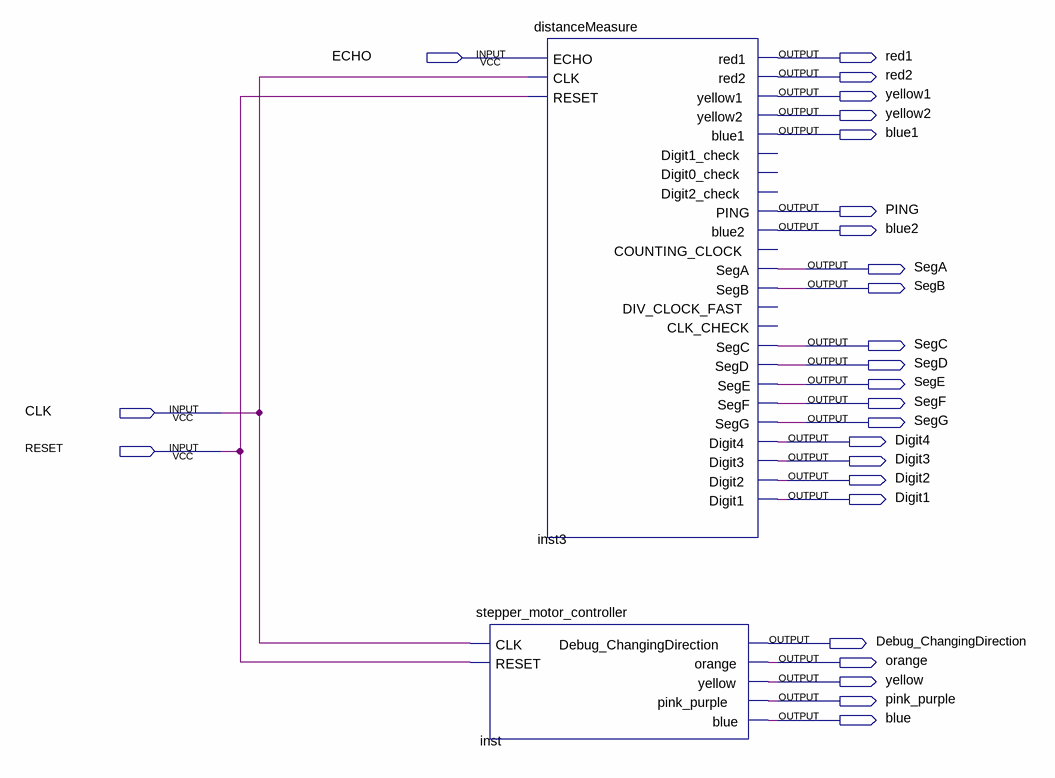
[diagram p0: schematic sheet]
// Quartus schematic FINAL_RADAR_SYSTEM_TOP_LEVEL.bdf as structural Verilog: 2 symbols, 26 pins
module FINAL_RADAR_SYSTEM_TOP_LEVEL (
  input  ECHO,
  input  CLK,
  input  RESET,
  output red1,
  output red2,
  output yellow1,
  output yellow2,
  output blue1,
  output PING,
  output blue2,
  output SegA,
  output SegB,
  output SegC,
  output SegD,
  output SegE,
  output SegF,
  output SegG,
  output Digit4,
  output Digit3,
  output Digit2,
  output Digit1,
  output Debug_ChangingDirection,
  output orange,
  output yellow,
  output pink_purple,
  output blue
);

  stepper_motor_controller inst (
    .CLK(CLK), .RESET(RESET), .Debug_ChangingDirection(Debug_ChangingDirection), .orange(orange),
    .yellow(yellow), .pink_purple(pink_purple), .blue(blue));
  distanceMeasure inst3 (
    .ECHO(ECHO), .CLK(CLK), .RESET(RESET), .red1(red1), .red2(red2), .yellow1(yellow1), .yellow2(yellow2),
    .blue1(blue1), .PING(PING), .blue2(blue2), .SegA(SegA), .SegB(SegB), .SegC(SegC), .SegD(SegD),
    .SegE(SegE), .SegF(SegF), .SegG(SegG), .Digit4(Digit4), .Digit3(Digit3), .Digit2(Digit2), .Digit1(Digit1));  // open: Digit1_check, Digit0_check, Digit2_check, COUNTING_CLOCK, DIV_CLOCK_FAST, CLK_CHECK
endmodule
